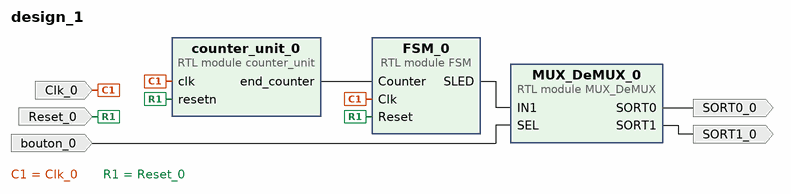
[diagram p0: block diagram of the top level]
# Vivado block design design_1, xc7z010clg400-1, Vivado 2024.1
create_bd_design design_1

create_bd_port -dir I -type rst Reset_0
create_bd_port -dir I -type clk Clk_0
create_bd_port -dir O SORT0_0
create_bd_port -dir O SORT1_0
create_bd_port -dir I bouton_0

create_bd_cell -type module -reference FSM FSM_0
create_bd_cell -type module -reference counter_unit counter_unit_0
set_property -dict {CONFIG.max 1 CONFIG.maxb 2} [get_bd_cells counter_unit_0]
create_bd_cell -type module -reference MUX_DeMUX MUX_DeMUX_0

# ---- connections ----

connect_bd_net -net Clk_0_1 [get_bd_ports Clk_0] [get_bd_pins counter_unit_0/clk] [get_bd_pins FSM_0/Clk]
connect_bd_net [get_bd_pins FSM_0/SLED] [get_bd_pins MUX_DeMUX_0/IN1]
connect_bd_net [get_bd_pins MUX_DeMUX_0/SORT0] [get_bd_ports SORT0_0]
connect_bd_net [get_bd_pins MUX_DeMUX_0/SORT1] [get_bd_ports SORT1_0]
connect_bd_net -net Reset_0_1 [get_bd_ports Reset_0] [get_bd_pins counter_unit_0/resetn] [get_bd_pins FSM_0/Reset]
connect_bd_net -net SEL_0_1 [get_bd_ports bouton_0] [get_bd_pins MUX_DeMUX_0/SEL]
connect_bd_net [get_bd_pins counter_unit_0/end_counter] [get_bd_pins FSM_0/Counter]

validate_bd_design
save_bd_design
